# Altium schematic sheet ATECC608A_Crypto_Authentication.SchDoc: ATECC608A Crypto Co-Processor
size A4
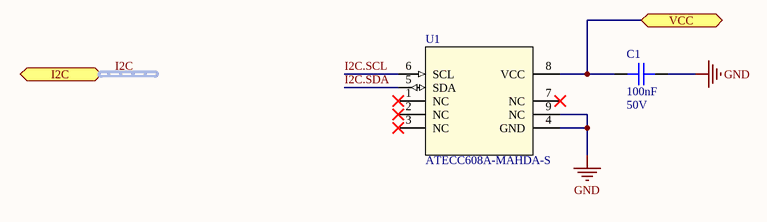
[diagram p0: ATECC608A_Crypto_Authentication.SchDoc]

## Parts
C1  Capacitance: 100nF  Voltage: 50V  [C0402]  (hidden comment: CAP CER 0.1UF 50V X7R 0402)
U1  ATECC608A-MAHDA-S  [UDFN8_2x3MC_MCH]

## Ports
I2C (harness I2C), VCC

## Nets
GND: C1.2 U1.4(GND) U1.9(NC)
I2C.SCL: U1.6(SCL)
I2C.SDA: U1.5(SDA)
VCC: C1.1 U1.8(VCC) ; port VCC

Not connected (* = marked no-connect by the designer): U1 1(NC)* 2(NC)* 3(NC)* 7(NC)*

## Buses and harness runs
harness I2C = port I2C

## Notes on the sheet
- Title
- Size:
- Date:
- A4
- Number:
- Time:
- Revision:
- Sheet
- of
- File:

## Library data of the parts
C1 = CAP CER 0.1UF 50V X7R 0402: 0.1µF ±10% 50V Ceramic Capacitor X7R 0402 (1005 Metric); Manufacturer: TDK; Manufacturer Part Number: CGA2B3X7R1H104K050BB; Supplier 1: Digi-Key; Stock 1: 2925303; Pricing 1: 1=0.17, 10=0.118, 50=0.0668, 100=0.0553, 500=0.0388, 1000=0.0321, 2500=0.0299, 5000=0.0273 (USD); Mount: Surface Mount; Case/Package: 0402; Weight: 2.3E-05oz; Case Code (Metric): 1005; Case Code (Imperial): 0402; Min Operating Temperature: -55°C; Max Operating Temperature: 125°C; Voltage Rating: 50V; Tolerance: 10%; Packaging: Tape and Reel; Package Quantity: 1; Voltage Rating (DC): 50V; Dielectric: X7R; Termination: SMD/SMT; Composition: Ceramic; Length: 1mm; Height: 0.5mm; Width: 0.02inch; Thickness: 0.022inch; Depth: 0.5mm; Ratings: AEC-Q200; REACH SVHC: No SVHC; Lead Free: Lead Free; ComponentLink1URL: http://product.tdk.com/capacitor/mlcc/en/documents/mlccspec_automotive_general_midvoltage_en.pdf?src-supplier=Future+Electronics; ComponentLink1Description: http://product.tdk.com/capacitor/mlcc/en/documents/mlccspec_automotive_general_midvoltage_en.pdf?src-supplier=Future+Electronics; ComponentLink2URL: http://www.farnell.com/datasheets/1807242.pdf?src-supplier=Element14; ComponentLink2Description: http://www.farnell.com/datasheets/1807242.pdf?src-supplier=Element14; ComponentLink3URL: http://www.mouser.com/ds/2/400/lcc_automotive_general_en-843974.pdf?src-supplier=Mouser; ComponentLink3Description: http://www.mouser.com/ds/2/400/lcc_automotive_general_en-843974.pdf?src-supplier=Mouser; ComponentLink4URL: http://www.farnell.com/datasheets/1936565.pdf?src-supplier=Element14; ComponentLink4Description: http://www.farnell.com/datasheets/1936565.pdf?src-supplier=Element14; ComponentLink5URL: http://www.farnell.com/datasheets/1735392.pdf?src-supplier=Element14; ComponentLink5Description: http://www.farnell.com/datasheets/1735392.pdf?src-supplier=Element14; Supplier Part Number 1: 445-6899-1-ND
U1 = IC ATECC608A-MAHDA-S AUTHENTICATION CHIP 8UDFN: Authentication Chip 8-UDFN (2x3); Manufacturer: Microchip; Supplier 1: Digi-Key; Manufacturer Part Number: ATECC608A-MAHDA-S; Stock 1: 2773; Pricing 1: 1=0.75, 25=0.7244, 100=0.6563 (USD); Mount: Surface Mount; Packaging: Cut Tape; ComponentLink1URL: http://ww1.microchip.com/downloads/en/DeviceDoc/40001977A.pdf?src-supplier=Farnell; ComponentLink1Description: http://ww1.microchip.com/downloads/en/DeviceDoc/40001977A.pdf?src-supplier=Farnell; ComponentLink2URL: http://ww1.microchip.com/downloads/en/DeviceDoc/40001977A.pdf?src-supplier=Newark; ComponentLink2Description: http://ww1.microchip.com/downloads/en/DeviceDoc/40001977A.pdf?src-supplier=Newark; ComponentLink3URL: http://ww1.microchip.com/downloads/en/DeviceDoc/40001977A.pdf?src-supplier=Element14; ComponentLink3Description: http://ww1.microchip.com/downloads/en/DeviceDoc/40001977A.pdf?src-supplier=Element14; ComponentLink4URL: http://www.microchip.com/mymicrochip/filehandler.aspx?ddocname=en601565&src-supplier=Digi-Key; ComponentLink4Description: http://www.microchip.com/mymicrochip/filehandler.aspx?ddocname=en601565&src-supplier=Digi-Key; Supplier Part Number 1: ATECC608A-MAHDA-SCT-ND